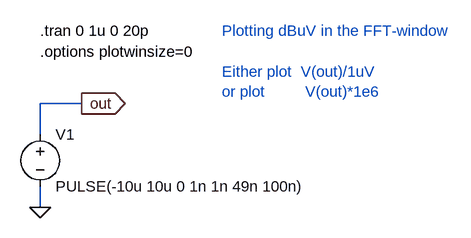
[diagram p0: schematic fft_dBuV.asc]
fft_dBuV.asc, the LTspice schematic file:
Version 4
SHEET 1 880 680
WIRE 176 64 112 64
WIRE 112 112 112 64
WIRE 112 224 112 192
FLAG 112 224 0
FLAG 176 64 out
IOPIN 176 64 Out
SYMBOL voltage 112 96 R0
WINDOW 123 0 0 Left 0
WINDOW 39 0 0 Left 0
SYMATTR InstName V1
SYMATTR Value PULSE(-10u 10u 0 1n 1n 49n 100n)
TEXT 112 -48 Left 0 !.tran 0 1u 0 20p
TEXT 112 -16 Left 0 !.options plotwinsize=0
TEXT 392 -48 Left 0 ;Plotting dBuV in the FFT-window\n \nEither plot  V(out)/1uV\nor plot         V(out)*1e6

The netlist it stands for:
* fft_dBuV.asc
V1 out 0 PULSE(-10u 10u 0 1n 1n 49n 100n)
.tran 0 1u 0 20p
.options plotwinsize=0
* Plotting dBuV in the FFT-window
* Either plot  V(out)/1uV
* or plot         V(out)*1e6
.backanno
.end